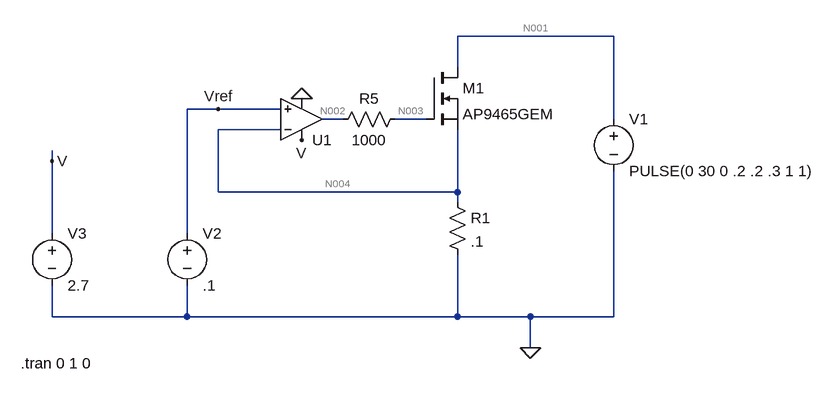
[diagram p0: schematic CurrentSink.asc]
CurrentSink.asc, the LTspice schematic file:
Version 4
SHEET 1 1252 680
WIRE 480 80 240 80
WIRE 240 128 240 80
WIRE -128 192 -176 192
WIRE -32 192 -128 192
WIRE 64 208 32 208
WIRE 192 208 144 208
WIRE 480 208 480 80
WIRE -32 224 -128 224
WIRE -384 272 -384 256
WIRE -128 320 -128 224
WIRE 240 320 240 224
WIRE 240 320 -128 320
WIRE 240 336 240 320
WIRE -384 384 -384 272
WIRE -176 384 -176 192
WIRE -384 512 -384 464
WIRE -176 512 -176 464
WIRE -176 512 -384 512
WIRE 240 512 240 416
WIRE 240 512 -176 512
WIRE 352 512 240 512
WIRE 480 512 480 288
WIRE 480 512 352 512
WIRE 352 560 352 512
FLAG 352 560 0
FLAG 0 176 0
FLAG -384 272 V
FLAG 0 240 V
FLAG -128 192 Vref
SYMBOL Opamps\\UniversalOpamp2 0 208 M180
SYMATTR InstName U1
SYMBOL res 224 320 R0
SYMATTR InstName R1
SYMATTR Value .1
SYMBOL voltage 480 192 R0
WINDOW 123 0 0 Left 2
WINDOW 39 0 0 Left 2
SYMATTR InstName V1
SYMATTR Value PULSE(0 30 0 .2 .2 .3 1 1)
SYMBOL voltage -176 368 R0
WINDOW 123 0 0 Left 2
WINDOW 39 0 0 Left 2
SYMATTR InstName V2
SYMATTR Value .1
SYMBOL voltage -384 368 R0
WINDOW 123 0 0 Left 2
WINDOW 39 0 0 Left 2
SYMATTR InstName V3
SYMATTR Value 2.7
SYMBOL nmos 192 128 R0
SYMATTR InstName M1
SYMATTR Value AP9465GEM
SYMBOL res 160 192 R90
WINDOW 0 0 56 VBottom 2
WINDOW 3 32 56 VTop 2
SYMATTR InstName R5
SYMATTR Value 1000
TEXT -432 584 Left 2 !.tran 0 1 0

The netlist it stands for:
* CurrentSink.asc
XU1 Vref N004 V 0 N002 level.2 Avol=1Meg GBW=10Meg Slew=10Meg ilimit=25m rail=0 Vos=0 phimargin=45 en=0 enk=0 in=0 ink=0 Rin=500Meg  ; pins IN+ IN- V+ V- OUT
R1 N004 0 .1
V1 N001 0 PULSE(0 30 0 .2 .2 .3 1 1)
V2 Vref 0 .1
V3 V 0 2.7
M1 N001 N003 N004 N004 AP9465GEM
R5 N003 N002 1000
.model NMOS NMOS
.model PMOS PMOS
.lib standard.mos
.tran 0 1 0
.lib UniversalOpamps2.sub
.backanno
.end

* Results of the author's LTspice run, read from the files saved beside the schematic
* Operating Point, zero values left out:
*   V(n002) = 2.7 V
*   V(v) = 2.7 V
*   V(vref) = 100 mV
*   V(n003) = 2.7 V
*   Id(M1) = -1.764 nA
*   Is(M1) = 1.764 nA
*   I(R1) = 935.7 pA
*   I(V3) = -307.6 nA
*   I(V2) = 2.5 nA
*   I(V1) = 1.764 nA
*   Ix(u1:1) = -2.5 nA
*   Ix(u1:2) = -2.7 nA
*   Ix(u1:3) = 307.6 nA
*   Ix(u1:4) = -343.7 nA
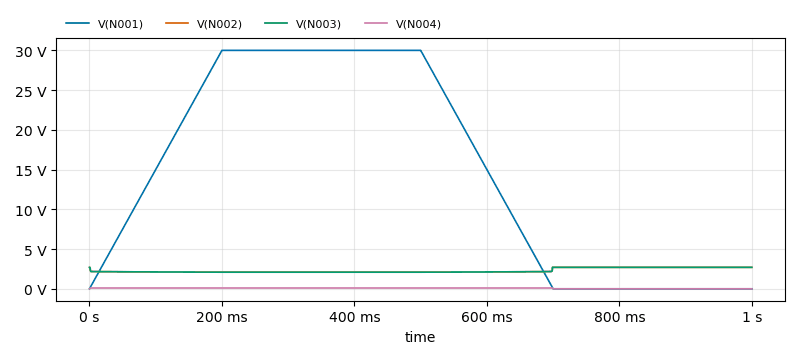
[diagram p1: Transient Analysis of CurrentSink.asc, plotted from the saved traces]
* Transient Analysis, 1 run:
*   V(N001): min 0 V, max 30 V, average 15 V, rms 19.88 V, last 0 V
*   V(N002): min 2.09 V, max 2.7 V, average 2.288 V, rms 2.304 V, last 2.7 V
*   V(N003): min 2.09 V, max 2.7 V, average 2.288 V, rms 2.304 V, last 2.7 V
*   V(N004): min 0 V, max 100 mV, average 69.89 mV, rms 83.58 mV, last 0 V